# Altium schematic sheet LionIRVT-PMP15043-1.SchDoc
size A4; Date: Not shown in title block; ApprovedBy: Not shown in title block; CheckedBy: Not shown in title block; Author: Not shown in title block; CompanyName: Not shown in title block; Engineer: Not shown in title block; Organization: Not shown in title block; Address1: Not shown in title block; Address2: Not shown in title block; Address3: Not shown in title block; Address4: Not shown in title block; DocumentNumber: 1; Revision: Use project parameter SCH_Rev; SheetNumber: 2; SheetTotal: 3; PageSetup: Record=PageOptions|CenterHorizontal=True|CenterVertical=True|PrintScale=1.00|XCorrection=1.00|YCorrection=1.00|PrintKind=0|BorderSize=5000000|LeftOffset=0|BottomOffset=0|Orientation=2|PaperLength=1000|PaperWidth=1000|Scale=100|PaperSource=15|PrintQuality=600|MediaType=1|DitherType=10|PaperKind=Letter|PrintScaleMode=1; CurrentTime: Not shown in title block; CurrentDate: Not shown in title block; Time: Not shown in title block; DocumentFullPathAndName: Not shown in title block; DocumentName: Not shown in title block; ModifiedDate: Not shown in title block; ImagePath: Not shown in title block
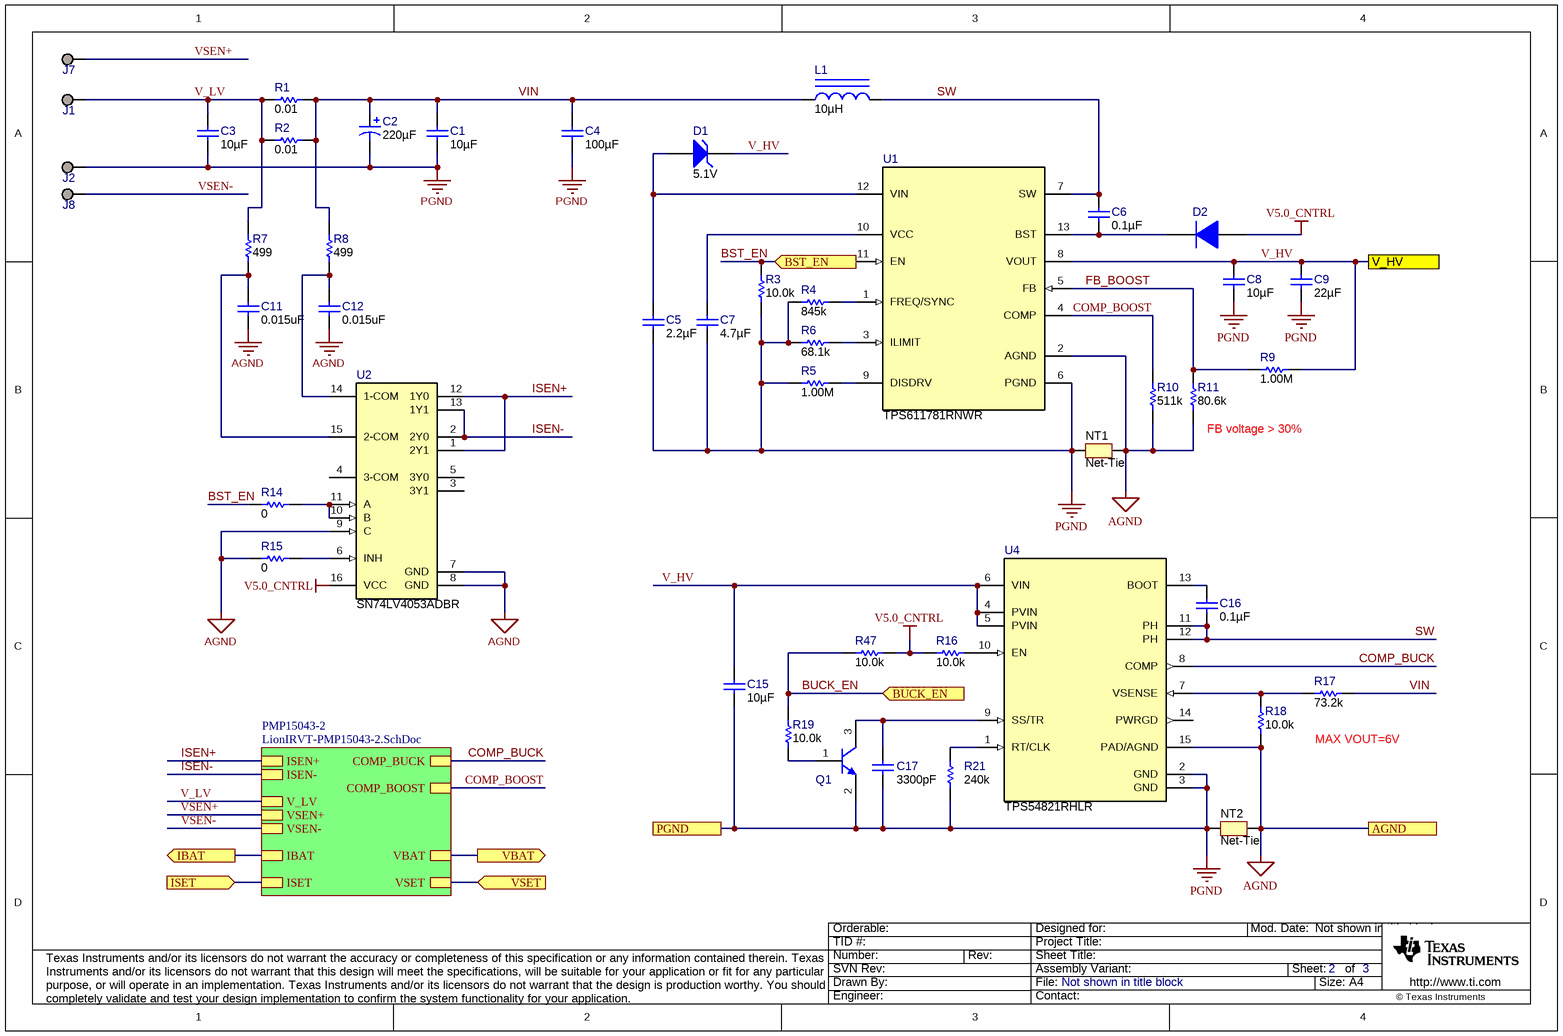
[diagram p0: LionIRVT-PMP15043-1.SchDoc]

## Parts
C1  ValueDisplayed: 10µF  [0603]  (hidden comment: GRM188R61E106MA73D)
C2  ValueDisplayed: 220µF  [SM_RADIAL_G]  (hidden comment: EEE-FC1E221P)
C3  ValueDisplayed: 10µF  [0603]  (hidden comment: GRM188R61E106MA73D)
C4  ValueDisplayed: 100µF  [1210_270]  (hidden comment: GRM32ER61A107ME20L)
C5  ValueDisplayed: 2.2µF  [0402_070]  (hidden comment: GRM155R61E225KE11D)
C6  ValueDisplayed: 0.1µF  [0402]  (hidden comment: GRM155R61C104KA88D)
C7  ValueDisplayed: 4.7µF  [0402]  (hidden comment: GRM155R61A475MEAAD)
C8  ValueDisplayed: 10µF  [0603]  (hidden comment: GRM188R61E106MA73D)
C9  ValueDisplayed: 22µF  [1210_270]  (hidden comment: GRM32ER61E226KE15L)
C11  ValueDisplayed: 0.015uF  [0603]  (hidden comment: Capacitor)
C12  ValueDisplayed: 0.015uF  [0603]  (hidden comment: Capacitor)
C15  ValueDisplayed: 10µF  [0603]  (hidden comment: GRM188R61E106MA73D)
C16  ValueDisplayed: 0.1µF  [0402]  (hidden comment: GRM155R61C104KA88D)
C17  ValueDisplayed: 3300pF  [0402]  (hidden comment: GRM155R71H332KA01D)
D1  value 5.1V  [SOD-323]  (hidden comment: BZT52C5V1S-7-F)
D2  1N4148X-TP  [SOD-523]  (value not drawn)
J1  Suggest using a net name here  [Keystone1502-2]  (value not drawn)
J2  Suggest using a net name here  [Keystone1502-2]  (value not drawn)
J7  Suggest using a net name here  [Keystone1502-2]  (value not drawn)
J8  Suggest using a net name here  [Keystone1502-2]  (value not drawn)
L1  ValueDisplayed: 10µH  [WE-HCC_1210]  (hidden comment: 7443321000)
NT1  Net-Tie  [Net-Tie_10mil]  (net tie, no BOM)
NT2  Net-Tie  [Net-Tie_10mil]  (net tie, no BOM)
Q1  MMBT3904-7-F  [SOT-23]  (value not drawn)
R1  ValueDisplayed: 0.01  [2010]  (hidden comment: CSRN2010FK10L0)
R2  ValueDisplayed: 0.01  [2010]  (hidden comment: CSRN2010FK10L0)
R3  ValueDisplayed: 10.0k  [0402]  (hidden comment: CRCW040210K0FKED)
R4  ValueDisplayed: 845k  [0402]  (hidden comment: CRCW0402845KFKED)
R5  ValueDisplayed: 1.00M  [0402]  (hidden comment: CRCW04021M00FKED)
R6  ValueDisplayed: 68.1k  [0402]  (hidden comment: CRCW040268K1FKED)
R7  ValueDisplayed: 499  [0603]  (hidden comment: CRCW0603499RFKEA)
R8  ValueDisplayed: 499  [0603]  (hidden comment: CRCW0603499RFKEA)
R9  ValueDisplayed: 1.00M  [0402]  (hidden comment: CRCW04021M00FKED)
R10  ValueDisplayed: 511k  [0402]  (hidden comment: CRCW0402511KFKED)
R11  ValueDisplayed: 80.6k  [0402]  (hidden comment: CRCW040280K6FKED)
R14  ValueDisplayed: 0  [0603]  (hidden comment: CRCW06030000Z0EA)
R15  ValueDisplayed: 0  [0603]  (hidden comment: CRCW06030000Z0EA)
R16  ValueDisplayed: 10.0k  [0402]  (hidden comment: CRCW040210K0FKED)
R17  ValueDisplayed: 73.2k  [0402]  (hidden comment: CRCW040273K2FKED)
R18  ValueDisplayed: 10.0k  [0402]  (hidden comment: CRCW040210K0FKED)
R19  ValueDisplayed: 10.0k  [0402]  (hidden comment: CRCW040210K0FKED)
R21  ValueDisplayed: 240k  [0402]  (hidden comment: CRCW0402240KFKED)
R47  ValueDisplayed: 10.0k  [0402]  (hidden comment: CRCW040210K0FKED)
U1  TPS611781RNWR  [RNW0013A]
U2  SN74LV4053ADBR  [DB0016A_N]
U4  TPS54821RHLR  [RHL0014A]

## Sub-sheets
PMP15043-2 = LionIRVT-PMP15043-2.SchDoc: VSET, VBAT, COMP_BUCK, COMP_BOOST, ISEN-, V_LV, IBAT, VSEN-, VSEN+, ISET, ISEN+

## Ports
AGND, BST_EN (in), BUCK_EN (in), IBAT (out), ISET (in), PGND, V_HV, VBAT (out), VSET (in)

## Nets
AGND: C11.2 C12.2 NT1.2 NT2.2 R10.1 R11.1 R15.1 R18.1 U1.2(AGND) U2.7(GND) U2.8(GND) U2.9(C) U4.15(PAD/AGND) ; port AGND
PGND: C1.2 C2.2(-) C3.2 C4.2 C5.1 C7.2 C8.2 C9.2 C15.2 C17.2 J2.1 NT1.1 NT2.1 Q1.2(E) R3.1 R4.1 R5.1 R6.1 R21.1 U1.6(PGND) U4.2(GND) U4.3(GND) ; port PGND
V5.0_CNTRL: D2.2(A) R16.1 R47.2 U2.16(VCC)
BST_EN: R3.2 R14.1 U1.11(EN) ; port BST_EN
BUCK_EN: R19.1 R47.1 ; port BUCK_EN
COMP_BOOST: R10.2 U1.4(COMP) ; sheet PMP15043-2/COMP_BOOST
COMP_BUCK: U4.8(COMP) ; sheet PMP15043-2/COMP_BUCK
FB_BOOST: R9.1 R11.2 U1.5(FB)
IBAT: port IBAT, sheet PMP15043-2/IBAT
ISEN+: U2.1(2Y1) U2.12(1Y0) ; sheet PMP15043-2/ISEN+
ISEN-: U2.2(2Y0) U2.13(1Y1) ; sheet PMP15043-2/ISEN-
ISET: port ISET, sheet PMP15043-2/ISET
SW: C6.1 C16.2 L1.2 U1.7(SW) U4.11(PH) U4.12(PH)
V_HV: C8.1 C9.1 C15.1 D1.1(K) R9.2 U1.8(VOUT) U4.4(PVIN) U4.5(PVIN) U4.6(VIN) ; port V_HV
V_LV: C3.1 J1.1 R1.1 R2.1 R7.2 ; sheet PMP15043-2/V_LV
VBAT: port VBAT, sheet PMP15043-2/VBAT
VIN: C1.1 C2.1(+) C4.1 L1.1 R1.2 R2.2 R8.2 R17.1
VSEN+: J7.1 ; sheet PMP15043-2/VSEN+
VSEN-: J8.1 ; sheet PMP15043-2/VSEN-
VSET: port VSET, sheet PMP15043-2/VSET
NetC5_2: C5.2 D1.2(A) U1.12(VIN)
NetC6_2: C6.2 D2.1(K) U1.13(BST)
NetC7_1: C7.1 U1.10(VCC)
NetC11_1: C11.1 R7.1 U2.15(2-COM)
NetC12_1: C12.1 R8.1 U2.14(1-COM)
NetC16_1: C16.1 U4.13(BOOT)
NetC17_1: C17.1 Q1.3(C) U4.9(SS/TR)
NetQ1_1: Q1.1(B) R19.2
NetR4_2: R4.2 U1.1(FREQ/SYNC)
NetR5_2: R5.2 U1.9(DISDRV)
NetR6_2: R6.2 U1.3(ILIMIT)
NetR14_2: R14.2 U2.10(B) U2.11(A)
NetR15_2: R15.2 U2.6(INH)
NetR16_2: R16.2 U4.10(EN)
NetR17_2: R17.2 R18.2 U4.7(VSENSE)
NetR21_2: R21.2 U4.1(RT/CLK)

Not connected (* = marked no-connect by the designer): U2 3(3Y1) 4(3-COM) 5(3Y0); U4 14(PWRGD)

## Notes on the sheet
- (near R11) FB voltage > 30%
- MAX VOUT=6V
- Drawn By:
- SVN Rev:
- Number:
- TID #:
- Orderable:
- Rev:
- Sheet Title:
- File:
- Project Title:
- Designed for:
- Assembly Variant:
- Mod. Date:
- Sheet:
- Size:
- of
- A4
- http://www.ti.com
- Texas Instruments and/or its licensors do not warrant the accuracy or completeness of this specification or any information contained therein. Texas Instruments and/or its licensors do not warrant that this design will meet the specifications, will be suitable for your application or fit for any particular purpose, or will operate in an implementation. Texas Instruments and/or its licensors do not warrant that the design is production worthy. You should completely validate and test your design implementation to confirm the system functionality for your application.
- Engineer:
- Contact:
- © Texas Instruments

## Library data of the parts
C1 C3 C8 C15 = GRM188R61E106MA73D: CAP, CERM, 10 µF, 25 V, +/- 20%, X5R, 0603; Manufacturer: MuRata; Polarized: N; CompType: Capacitor; Value: 10uF; U/M: EA; Cap_F: 0.00001; Tolerance_%: 20; Value1: Unknown; VDC_V: 25; Value2: 25V; TaMin_C: -55; TaMax_C: 85; AEC Category: Q200; SymbolVersion: 2008-07-09; PartNumber: GRM188R61E106MA73D; PackageReference: 0603; RoHS: Y; MountType: SMT; Technology: Ceramic; TempCo: X5R; Cap_Case: 0603; Published: 2008-06-19; Publisher: Texas Instruments; LatestRevisionDate: 2016-04-09; ComponentLink1Description: Datasheet link; ComponentLink1URL: http://psearch.murata.com/capacitor/product/GRM188R61E106MA73%23.pdf; Supplier 1: Digi-Key; Supplier Part Number 1: 490-7202-1-ND; Supplier 2: Mouser; Supplier Part Number 2: 81-GRM188R61E106MA3L; Supplier 3: Farnell; Supplier Part Number 3: 1828803RL; AEC Qualified: ?
C2 = EEE-FC1E221P: CAP, AL, 220 µF, 25 V, +/- 20%, 0.15 ohm, SMD; Manufacturer: Panasonic; Polarized: Y; CompType: Capacitor; Value: 220uF; U/M: EA; Cap_F: 0.00022; Tolerance_%: 20; VDC_V: 25; Value2: 25V; ESR_ohm: 0.15; IRMS_A: 0.67; TaMin_C: -40; TaMax_C: 105; Cap_Case: G; SizeAreaWB_mm2: 172.2; SizeArea_mm2: 123.6; SizeX_mm: 12; SizeY_mm: 10.3; SizeZ_mm: 10.2; AEC Category: Q200; SymbolVersion: 2008-07-09; PartNumber: EEE-FC1E221P; PackageReference: SMT Radial G; RoHS: Y; Value1: 0.15 ohm; MountType: SMT; Technology: AL; Series: FC; Publisher: Texas Instruments; LatestRevisionDate: 2017-03-23; ComponentLink1Description: Datasheet link; ComponentLink1URL: http://www.panasonic.com/industrial/components/pdf/smt_aec_050505.pdf; Supplier 1: Digi-Key; Supplier Part Number 1: PCE4005CT-ND; Supplier 2: Mouser; Supplier Part Number 2: 667-EEE-FC1E221P; Supplier 3: Farnell; Supplier Part Number 3: 1244363; AEC Qualified: ?
C4 = GRM32ER61A107ME20L: CAP, CERM, 100 µF, 10 V,+/- 20%, X5R, 1210; Manufacturer: MuRata; Polarized: N; CompType: Capacitor; Value: 100uF; U/M: EA; Cap_F: 0.0001; Tolerance_%: 20; Value1: Unknown; VDC_V: 10; Value2: 10V; TaMin_C: -55; TaMax_C: 85; Cap_Case: 1210; SizeArea_mm2: 8; SizeAreaWB_mm2: 14.7; SizeX_mm: 3.2; SizeY_mm: 2.5; SizeZ_mm: 2.7; AEC Category: Q200; SymbolVersion: 2008-07-09; PartNumber: GRM32ER61A107ME20L; PackageReference: 1210; RoHS: Y; MountType: SMT; Technology: Ceramic; TempCo: X5R; Published: 2008-06-19; Publisher: Texas Instruments; LatestRevisionDate: 2017-06-02; ComponentLink1Description: Datasheet link; ComponentLink1URL: http://www.murata.com/~/media/webrenewal/support/library/catalog/products/capacitor/mlcc/c02e.pdf; Supplier 1: Digi-Key; Supplier Part Number 1: 490-9969-1-ND; Supplier 2: Mouser; Supplier Part Number 2: 81-GRM32ER61A107ME0L; AEC Qualified: N; AEC Grade: N/A
C5 = GRM155R61E225KE11D: CAP, CERM, 2.2 µF, 25 V,+/- 10%, X5R, 0402; Manufacturer: MuRata; Polarized: N; CompType: Capacitor; Value: 2.2uF; U/M: EA; Cap_F: 0.0000022; Tolerance_%: 10; Value1: Unknown; VDC_V: 25; Value2: 25V; TaMin_C: -55; TaMax_C: 85; Cap_Case: 0402; AEC Category: Q200; SizeArea_mm2: 0.5; SizeAreaWB_mm2: 3; SizeX_mm: 1; SizeZ_mm: 0.7; Green_Lifecycle: Active; Green_REACh: Passed; SymbolVersion: 2008-07-09; PartNumber: GRM155R61E225KE11D; PackageReference: 0402; RoHS: Y; MountType: SMT; Technology: Ceramic; TempCo: X5R; Published: 2008-06-19; Publisher: Texas Instruments; LatestRevisionDate: 2017-06-02; ComponentLink1Description: Datasheet link; ComponentLink1URL: http://www.murata.com/~/media/webrenewal/support/library/catalog/products/capacitor/mlcc/c02e.ashx; Supplier 1: Digi-Key; Supplier Part Number 1: GRM155R61E225KE11D-ND; Supplier 2: Mouser; Supplier Part Number 2: 81-GRM155R61E225KE1D; AEC Qualified: ?; SizeY_mm: 0.5; Green_EU RoHS: Passed; Green_EU RoHS-2: Incomplete
C6 C16 = GRM155R61C104KA88D: CAP, CERM, 0.1 µF, 16 V, +/- 10%, X5R, 0402; Manufacturer: MuRata; Polarized: N; CompType: Capacitor; Value: 0.1uF; U/M: EA; Cap_F: 0.0000001; Tolerance_%: 10; Value1: Unknown; VDC_V: 16; Value2: 16V; TaMin_C: -55; TaMax_C: 85; AEC Category: Q200; SymbolVersion: 2008-07-09; PartNumber: GRM155R61C104KA88D; PackageReference: 0402; RoHS: Y; MountType: SMT; Technology: Ceramic; TempCo: X5R; Cap_Case: 0402; Published: 2008-06-19; Publisher: Texas Instruments; LatestRevisionDate: 2016-04-09; ComponentLink1Description: Datasheet link; ComponentLink1URL: http://search.murata.co.jp/Ceramy/PnsearchViewAction.do?HnOFG=ON&HnNFG=ON&SEL_CNT=50&sLang=en&sKey=GRM155R61C104KA88D&x=9&y=9&search=startwith; Supplier 1: Digi-Key; Supplier Part Number 1: 490-5415-1-ND; Supplier 2: Mouser; Supplier Part Number 2: 81-GRM155R61C104KA8D; AEC Qualified: ?
C7 = GRM155R61A475MEAAD: CAP, CERM, 4.7 µF, 10 V, +/- 20%, X5R, 0402; Manufacturer: MuRata; Polarized: N; CompType: Capacitor; Value: 4.7uF; U/M: EA; Cap_F: 0.0000047; Tolerance_%: 20; Value1: Unknown; VDC_V: 10; Value2: 10V; TaMin_C: -55; TaMax_C: 85; SizeArea_mm2: 0.5; SizeAreaWB_mm2: 3; SizeX_mm: 1; SizeZ_mm: 0.6; AEC Category: Q200; SymbolVersion: 2008-07-09; PartNumber: GRM155R61A475MEAAD; PackageReference: 0402; RoHS: Y; MountType: SMT; Technology: Ceramic; TempCo: X5R; Cap_Case: 0402; SizeY_mm: 0.5; Published: 2008-06-19; Publisher: Texas Instruments; LatestRevisionDate: 2016-11-23; ComponentLink1Description: Datasheet link; ComponentLink1URL: http://search.murata.co.jp/Ceramy/image/img/A01X/G101/ENG/GRM155R61A475MEAA-01.pdf; AEC Qualified: N; AEC Grade: N/A
C9 = GRM32ER61E226KE15L: CAP, CERM, 22 µF, 25 V, +/- 10%, X5R, 1210; Manufacturer: MuRata; Polarized: N; CompType: Capacitor; Value: 22uF; U/M: EA; Cap_F: 0.000022; Tolerance_%: 10; ESR_ohm: 0.002; Value1: 0.002 ohm; VDC_V: 25; Value2: 25V; IRMS_A: 3.67; TaMin_C: -55; TaMax_C: 85; Cap_Case: 1210; SizeArea_mm2: 8; SizeAreaWB_mm2: 14.7; SizeX_mm: 3.2; SizeY_mm: 2.5; SizeZ_mm: 2.7; AEC Category: Q200; SymbolVersion: 2008-07-09; PartNumber: GRM32ER61E226KE15L; PackageReference: 1210; RoHS: Y; MountType: SMT; Technology: Ceramic; TempCo: X5R; Published: 2008-06-19; Publisher: Texas Instruments; LatestRevisionDate: 2016-11-23; ComponentLink1Description: Datasheet link; ComponentLink1URL: http://search.murata.co.jp/Ceramy/PnsearchViewAction.do?HnOFG=ON&HnNFG=ON&SEL_CNT=50&sLang=en&sKey=GRM32ER61E226KE15L&x=9&y=9&search=startwith; Supplier 1: Mouser; Supplier Part Number 1: 81-GRM32ER61E226KE15; Supplier 2: Farnell; Supplier Part Number 2: 1828821; AEC Qualified: ?
C11 C12 = CMP-0007383-5: CAP, CERM, 0.015 uF, 16 V, +/- 10%, X7R, 0603; PartNumber: GRM188R71C153KA01D; Manufacturer: MuRata; Polarized: N; U/M: EA; Cap_F: 15nF; Value1: Unknown; VDC_V: 16V; TaMin_C: -55°C; TaMax_C: 125°C; SizeArea_mm2: 1.28; SizeAreaWB_mm2: 4.68; SizeX_mm: 1.6; SizeY_mm: 0.8; SizeZ_mm: 1; AEC Category: Q200; CompType: Capacitor; Value: 0.015uF; PackageReference: 0603; RoHS: Y; Tolerance_%: 10%; Value2: 16V; MountType: SMT; Technology: Ceramic; TempCo: X7R; Cap_Case: 0603; Published: 2008-06-19; Publisher: Texas Instruments; LatestRevisionDate: 2017-03-09; ComponentLink1Description: Datasheet link; ComponentLink1URL: http://search.murata.co.jp/Ceramy/PnsearchViewAction.do?HnOFG=ON&HnNFG=ON&SEL_CNT=50&sLang=en&sKey=GRM188R71C153KA01D&x=9&y=9&search=startwith; Supplier 1: Mouser; Supplier Part Number 1: 81-GRM188R71C153KA; AEC Qualified: ?
C17 = GRM155R71H332KA01D: CAP, CERM, 3300 pF, 50 V,+/- 10%, X7R, 0402; Manufacturer: MuRata; Polarized: N; CompType: Capacitor; Value: 3300pF; U/M: EA; Cap_F: 0.0000000033; Tolerance_%: 10; Value1: Unknown; VDC_V: 50; Value2: 50V; TaMin_C: -55; TaMax_C: 125; SizeArea_mm2: 0.5; SizeAreaWB_mm2: 3; SizeX_mm: 1; SizeZ_mm: 0.6; AEC Category: Q200; Green_Lifecycle: Active; Green_REACh: Passed; SymbolVersion: 2008-07-09; PartNumber: GRM155R71H332KA01D; PackageReference: 0402; RoHS: Y; MountType: SMT; Technology: Ceramic; TempCo: X7R; Cap_Case: 0402; SizeY_mm: 0.5; Published: 2008-06-19; Publisher: Texas Instruments; LatestRevisionDate: 2017-06-02; ComponentLink1Description: Datasheet link; ComponentLink1URL: http://search.murata.co.jp/Ceramy/PnsearchViewAction.do?HnOFG=ON&HnNFG=ON&SEL_CNT=50&sLang=en&sKey=GRM155R71H332KA01D&x=9&y=9&search=startwith; Supplier 1: Digi-Key; Supplier Part Number 1: 490-3248-1-ND; Supplier 2: Mouser; Supplier Part Number 2: 81-GRM36X332K50; AEC Qualified: ?; Green_EU RoHS: Passed; Green_EU RoHS-2: Passed
D1 = BZT52C5V1S-7-F: Diode, Zener, 5.1 V, 200 mW, SOD-323; Manufacturer: Diodes Inc.; SymbolCreator: a0412235; U/M: EA; Power_W: 0.2; Vz_V: 5.1; Value1: 0.2W; RJA_CperW: 625; SizeAreaWB_mm2: 8.695; SizeArea_mm2: 3.645; SizeX_mm: 2.7; SizeY_mm: 1.35; SizeZ_mm: 1; AEC Category: Q101; Green_Lifecycle: Active; Green_REACh: Passed; SymbolVersion: 2010-08-25; PartNumber: BZT52C5V1S-7-F; PackageReference: SOD-323; CompType: Zener; Vr_V: N/A; MountType: SMT; RoHS: Y; ComponentLink1Description: Datasheet link; ComponentLink1URL: http://www.diodes.com/datasheets/ds30093.pdf; Published: 2008-10-08; Publisher: Texas Instruments; LatestRevisionDate: 2017-05-11; LatestRevisionNote: Updated Supplier Data; Supplier 1: Digi-Key; Supplier Part Number 1: BZT52C5V1S-FDICT-ND; Supplier 2: Mouser; Supplier Part Number 2: 621-BZT52C5V1S-F; AEC Qualified: ?; Green_EU RoHS: Passed; Green_EU RoHS-2: Passed
D2 = 1N4148X-TP: Diode, Switching, 75 V, 0.3 A, SOD-523; Manufacturer: Micro Commercial Components; U/M: EA; Vf_V: 1.25; Value: 75V; Value1: 0.3A; Value2: 1.25V; Io_A: 0.3; Vr_V: 75; TJmax_C: 150; SizeAreaWB_mm2: 5.13; SizeArea_mm2: 1.53; SizeX_mm: 1.7; SizeY_mm: 0.9; SizeZ_mm: 0.65; AEC Category: Q101; Green_Lifecycle: Not Set; Green_REACh: Incomplete; SymbolVersion: 2008-12-08; PartNumber: 1N4148X-TP; PackageReference: SOD-523; CompType: Diode; MountType: SMT; Type: Switching; RoHS: Y; Published: 2008-06-26; Publisher: Texas Instruments; LatestRevisionDate: 2017-05-30; ComponentLink1Description: Datasheet link; ComponentLink1URL: http://www.mccsemi.com/up_pdf/1N4148X(SOD-523).PDF; Supplier 1: Digi-Key; Supplier Part Number 1: 1N4148XTPMSCT-ND; Supplier 2: Newark; Supplier Part Number 2: 69R6666; Supplier 3: Mouser; Supplier Part Number 3: 833-1N4148X-TP; AEC Qualified: ?; Green_EU RoHS: Incomplete; Green_EU RoHS-2: Incomplete
J1 J2 J7 J8 = 1502-2: Terminal, Turret, TH, Double; Manufacturer: Keystone; CompType: Turret Terminal; U/M: EA; SymbolVersion: 2010-10-20; PartNumber: 1502-2; PackageReference: Keystone1502-2; RoHS: Y; MountType: TH; ComponentLink1Description: Datasheet Link; ComponentLink1URL: http://www.keyelco.com/pdfs/M55p126.pdf; Value: Double; Publisher: Texas Instruments; LatestRevisionDate: 2015-05-13; Supplier 1: Digi-Key; Supplier Part Number 1: 1502-2K-ND
L1 = 7443321000: Inductor, Shielded Drum Core, Ferrite, 10 µH, 9 A, 0.0144 ohm, SMD; Manufacturer: Wurth Elektronik; Value: 10uH; Ind_H: 10.0E-6; Imax_A: 9; Irms: 9A @ 50C rise; Isat: 10A @ 30% inductance drop; DCR_ohm: 0.0144; Value2: 9A; SizeAreaWB_mm2: 188.94; SizeArea_mm2: 137.94; SizeX_mm: 12.1; SizeY_mm: 11.4; SizeZ_mm: 10; AEC Category: Q200; Green_Lifecycle: Active; Green_REACh: Passed; SymbolVersion: 2008-07-23; CompType: Inductor; PartNumber: 7443321000; Value1: 0.0144 ohm; Technology: Shielded Drum Core; MountType: SMT; Material: Ferrite; PackageReference: 12.1x9.5x11.4mm; Published: 2008-06-26; Publisher: Texas Instruments; LatestRevisionDate: 2017-05-24; ComponentLink1Description: Datasheet link; ComponentLink1URL: http://katalog.we-online.de/pbs/datasheet/7443321000.pdf; RoHS: Y; Supplier 1: Digi-Key; Supplier Part Number 1: 732-2145-1-ND; Supplier 2: Mouser; Supplier Part Number 2: 710-7443321000; Supplier 3: Farnell; Supplier Part Number 3: 1848238; AEC Qualified: ?; Green_EU RoHS: Passed; Green_EU RoHS-2: Incomplete
NT1 NT2 = Net-Tie: Single point connection between nets.; SymbolCreator: codlsc; SymbolVersion: 2009-07-01; MountType: SMT; PackageReference: N/A; Publisher: Texas Instruments; LatestRevisionDate: 2014-10-27; LatestRevisionNote: Added Alternate PartNumber and Alternate Manufacturer parameters to appropriate components.
Q1 = MMBT3904-7-F, Diodes Inc.: Transistor, NPN, 40 V, 0.2 A, SOT-23; CompType: BJT; PNP: 0; NPN: 1; Vceo_V: 40; Vcesat1_V: 0.2; Value: 40 V; Value1: 0.2 A; HfeMax: 400; TaMin_C: -55; TaMax_C: 150; SizeAreaWB_mm2: 14; SizeArea_mm2: 7.5; SizeX_mm: 2.5; SizeY_mm: 3; SizeZ_mm: 1.1; U/M: EA; AEC Category: Q101; SymbolVersion: 2008-07-31; PartNumber: MMBT3904-7-F; Manufacturer: Diodes Inc.; PackageReference: SOT-23; RoHS: Y; IcRated_A: 0.2; Value2: 400; Published: 2008-07-31; LatestRevisionDate: 2017-03-24; Publisher: Texas Instruments; ComponentLink1Description: Datasheet link; ComponentLink1URL: http://www.diodes.com/datasheets/ds30036.pdf; Supplier 1: Digi-Key; Supplier Part Number 1: MMBT3904-FDICT-ND; Supplier 2: Farnell; Supplier Part Number 2: 1773602; MountType: SMT; AEC Qualified: ?
R1 R2 = CSRN2010FK10L0: RES, 0.01, 1%, 1 W, 2010; Manufacturer: Stackpole Electronics Inc; CompType: Resistor; Value: 0.01; Value_Code: R010; Tolerance_%: 1; Value2: 1W; TempCo: 250 ppm/C; SizeArea_mm2: 12.5; SizeX_mm: 5; SizeY_mm: 2.5; SizeZ_mm: 1.66; EIA_Code: E96; U/M: EA; AEC Category: Q200; SymbolVersion: 2009-05-29; PartNumber: CSRN2010FK10L0; PackageReference: 2010; RoHS: Y; Res_ohm: 0.01; Value1: 1%; Power_W: 1; MountType: SMT; Technology: Thick Film; Published: 2008-06-26; Publisher: Texas Instruments; LatestRevisionDate: 2017-04-20; ComponentLink1Description: Datasheet link; ComponentLink1URL: http://www.seielect.com/Catalog/SEI-csr.pdf; Supplier 1: Digi-Key; Supplier Part Number 1: CSRN2010FK10L0CT-ND; AEC Qualified: ?
R3 R16 R18 R19 R47 = CRCW040210K0FKED: RES, 10.0 k, 1%, 0.063 W, 0402; Manufacturer: Vishay-Dale; CompType: Resistor; Value: 10.0k; Res_ohm: 10000; Value_Code: 10k0; Tolerance_%: 1; Power_W: 0.063; Value2: 0.063W; VDC_V: 50; TempCo: 100 ppm/C; SizeArea_mm2: 0.5; SizeZ_mm: 0.6; EIA_Code: E96; U/M: EA; AEC Category: Q200; SymbolVersion: 2009-05-29; PartNumber: CRCW040210K0FKED; PackageReference: 0402; RoHS: Y; Value1: 1%; MountType: SMT; Technology: Thick Film; SizeX_mm: 1; SizeY_mm: 0.5; Published: 2008-06-26; Publisher: Texas Instruments; LatestRevisionDate: 2017-03-21; ComponentLink1Description: Datasheet link; ComponentLink1URL: http://www.vishay.com/docs/20035/dcrcwe3.pdf; Supplier 1: Digi-Key; Supplier Part Number 1: 541-10.0KLCT-ND; Supplier 2: Newark; Supplier Part Number 2: 52K6595; Supplier 3: Mouser; Supplier Part Number 3: 71-CRCW0402-10K-E3; AEC Qualified: ?
R4 = CRCW0402845KFKED: RES, 845 k, 1%, 0.063 W, 0402; Manufacturer: Vishay-Dale; CompType: Resistor; Value: 845k; Res_ohm: 845000; Tolerance_%: 1; Power_W: 0.063; Value2: 0.063W; VDC_V: 50; TempCo: 100 ppm/C; SizeArea_mm2: 0.5; SizeZ_mm: 0.6; EIA_Code: E96; U/M: EA; AEC Category: Q200; SymbolVersion: 2009-05-29; PartNumber: CRCW0402845KFKED; PackageReference: 0402; RoHS: Y; Value_Code: 845k; Value1: 1%; MountType: SMT; Technology: Thick Film; SizeX_mm: 1; SizeY_mm: 0.5; Published: 2008-06-26; Publisher: Texas Instruments; LatestRevisionDate: 2017-06-03; ComponentLink1Description: Datasheet link; ComponentLink1URL: http://www.vishay.com/docs/20035/dcrcwe3.pdf; Supplier 1: Digi-Key; Supplier Part Number 1: 541-845KLCT-ND; Supplier 2: Newark; Supplier Part Number 2: 52K7315; Supplier 3: Mouser; Supplier Part Number 3: 71-CRCW0402-845K-E3; AEC Qualified: ?
R5 R9 = CRCW04021M00FKED: RES, 1.00 M, 1%, 0.063 W, 0402; Manufacturer: Vishay-Dale; CompType: Resistor; Value: 1.00Meg; Res_ohm: 1000000; Value_Code: 1M00; Tolerance_%: 1; Power_W: 0.063; Value2: 0.063W; VDC_V: 50; TempCo: 100 ppm/C; SizeArea_mm2: 0.5; SizeZ_mm: 0.6; EIA_Code: E96; U/M: EA; AEC Category: Q200; SymbolVersion: 2009-05-29; PartNumber: CRCW04021M00FKED; PackageReference: 0402; RoHS: Y; Value1: 1%; MountType: SMT; Technology: Thick Film; SizeX_mm: 1; SizeY_mm: 0.5; Published: 2008-06-26; Publisher: Texas Instruments; LatestRevisionDate: 2016-06-07; ComponentLink1Description: Datasheet link; ComponentLink1URL: http://www.vishay.com/docs/20035/dcrcwe3.pdf; Supplier 1: Digi-Key; Supplier Part Number 1: 541-1.00MLCT-ND; Supplier 2: Mouser; Supplier Part Number 2: 71-CRCW0402-1.0M-E3; Supplier 3: Farnell; Supplier Part Number 3: 1469667; AEC Qualified: ?
R6 = CRCW040268K1FKED: RES, 68.1 k, 1%, 0.063 W, 0402; Manufacturer: Vishay-Dale; CompType: Resistor; Value: 68.1k; Res_ohm: 68100; Value_Code: 68k1; Tolerance_%: 1; Power_W: 0.063; Value2: 0.063W; VDC_V: 50; TempCo: 100 ppm/C; SizeArea_mm2: 0.5; SizeZ_mm: 0.6; EIA_Code: E96; U/M: EA; AEC Category: Q200; Green_Lifecycle: Active; Green_REACh: Passed; SymbolVersion: 2009-05-29; PartNumber: CRCW040268K1FKED; PackageReference: 0402; RoHS: Y; Value1: 1%; MountType: SMT; Technology: Thick Film; SizeX_mm: 1; SizeY_mm: 0.5; Published: 2008-06-26; Publisher: Texas Instruments; LatestRevisionDate: 2017-06-03; ComponentLink1Description: Datasheet link; ComponentLink1URL: http://www.vishay.com/docs/20035/dcrcwe3.pdf; Supplier 1: Digi-Key; Supplier Part Number 1: 541-68.1KLCT-ND; Supplier 2: Newark; Supplier Part Number 2: 52K7227; Supplier 3: Mouser; Supplier Part Number 3: 71-CRCW0402-68.1K-E3; AEC Qualified: ?; Green_EU RoHS: Passed with Exemption; Green_EU RoHS-2: Passed
R7 R8 = CRCW0603499RFKEA: RES, 499, 1%, 0.1 W, 0603; Manufacturer: Vishay-Dale; CompType: Resistor; Value: 499; Value_Code: 499R; Tolerance_%: 1; Power_W: 0.1; Value2: 0.1W; VDC_V: 75; TempCo: 100 ppm/C; SizeArea_mm2: 1.28; SizeX_mm: 1.6; SizeY_mm: 0.8; EIA_Code: E96; U/M: EA; AEC Category: Q200; Green_Lifecycle: Active; Green_REACh: Passed; SymbolVersion: 2009-05-29; PartNumber: CRCW0603499RFKEA; PackageReference: 0603; RoHS: Y; Res_ohm: 499; Value1: 1%; MountType: SMT; Technology: Thick Film; SizeZ_mm: 1; Published: 2008-06-26; Publisher: Texas Instruments; LatestRevisionDate: 2017-05-31; ComponentLink1Description: Datasheet link; ComponentLink1URL: http://www.vishay.com/docs/20035/dcrcwe3.pdf; Supplier 1: Digi-Key; Supplier Part Number 1: 541-499HCT-ND; Supplier 2: Newark; Supplier Part Number 2: 52K8569; Supplier 3: Mouser; Supplier Part Number 3: 71-CRCW0603-499-E3; AEC Qualified: ?; Green_EU RoHS: Passed with Exemption; Green_EU RoHS-2: Passed
R10 = CRCW0402511KFKED: RES, 511 k, 1%, 0.063 W, 0402; Manufacturer: Vishay-Dale; CompType: Resistor; Value: 511k; Res_ohm: 511000; Tolerance_%: 1; Power_W: 0.063; Value2: 0.063W; VDC_V: 50; TempCo: 100 ppm/C; SizeArea_mm2: 0.5; SizeZ_mm: 0.6; EIA_Code: E96; U/M: EA; AEC Category: Q200; SymbolVersion: 2009-05-29; PartNumber: CRCW0402511KFKED; PackageReference: 0402; RoHS: Y; Value_Code: 511k; Value1: 1%; MountType: SMT; Technology: Thick Film; SizeX_mm: 1; SizeY_mm: 0.5; Published: 2008-06-26; Publisher: Texas Instruments; LatestRevisionDate: 2017-06-03; ComponentLink1Description: Datasheet link; ComponentLink1URL: http://www.vishay.com/docs/20035/dcrcwe3.pdf; Supplier 1: Digi-Key; Supplier Part Number 1: 541-511KLCT-ND; Supplier 2: Newark; Supplier Part Number 2: 52K7134; Supplier 3: Mouser; Supplier Part Number 3: 71-CRCW0402-511K-E3; AEC Qualified: ?
R11 = CRCW040280K6FKED: RES, 80.6 k, 1%, 0.063 W, 0402; Manufacturer: Vishay-Dale; CompType: Resistor; Value: 80.6k; Res_ohm: 80600; Value_Code: 80k6; Tolerance_%: 1; Power_W: 0.063; Value2: 0.063W; VDC_V: 50; TempCo: 100 ppm/C; SizeArea_mm2: 0.5; SizeZ_mm: 0.6; EIA_Code: E96; U/M: EA; AEC Category: Q200; SymbolVersion: 2009-05-29; PartNumber: CRCW040280K6FKED; PackageReference: 0402; RoHS: Y; Value1: 1%; MountType: SMT; Technology: Thick Film; SizeX_mm: 1; SizeY_mm: 0.5; Published: 2008-06-26; Publisher: Texas Instruments; LatestRevisionDate: 2016-06-07; ComponentLink1Description: Datasheet link; ComponentLink1URL: http://www.vishay.com/docs/20035/dcrcwe3.pdf; Supplier 1: Digi-Key; Supplier Part Number 1: 541-80.6KLCT-ND; Supplier 2: Mouser; Supplier Part Number 2: 71-CRCW0402-80.6K-E3; Supplier 3: Farnell; Supplier Part Number 3: 1469736; AEC Qualified: ?
R14 R15 = CRCW06030000Z0EA: RES, 0, 5%, 0.1 W, 0603; Manufacturer: Vishay-Dale; CompType: Resistor; Value: 0; Value_Code: 0000; Tolerance_%: 5; Power_W: 0.1; Value2: 0.1W; VDC_V: 75; TempCo: 200 ppm/C; SizeArea_mm2: 1.28; SizeX_mm: 1.6; SizeY_mm: 0.8; SizeZ_mm: 1; EIA_Code: E24; U/M: EA; AEC Category: Q200; Green_Lifecycle: Active; Green_REACh: Passed; SymbolVersion: 2009-05-29; PartNumber: CRCW06030000Z0EA; PackageReference: 0603; RoHS: Y; Res_ohm: 0; Value1: 5%; MountType: SMT; Technology: Thick Film; Published: 2008-06-26; Publisher: Texas Instruments; LatestRevisionDate: 2017-05-31; ComponentLink1Description: Datasheet link; ComponentLink1URL: http://www.vishay.com/docs/20035/dcrcwe3.pdf; Supplier 1: Digi-Key; Supplier Part Number 1: 541-0.0GCT-ND; Supplier 2: Newark; Supplier Part Number 2: 52K8014; Supplier 3: Mouser; Supplier Part Number 3: 71-CRCW0603-0-E3; AEC Qualified: ?; Green_EU RoHS: Passed with Exemption; Green_EU RoHS-2: Passed
R17 = CRCW040273K2FKED: RES, 73.2 k, 1%, 0.063 W, 0402; Manufacturer: Vishay-Dale; CompType: Resistor; Value: 73.2k; Res_ohm: 73200; Value_Code: 73k2; Tolerance_%: 1; Power_W: 0.063; Value2: 0.063W; VDC_V: 50; TempCo: 100 ppm/C; SizeArea_mm2: 0.5; SizeZ_mm: 0.6; EIA_Code: E96; U/M: EA; AEC Category: Q200; Green_Lifecycle: Active; Green_REACh: Passed; SymbolVersion: 2009-05-29; PartNumber: CRCW040273K2FKED; PackageReference: 0402; RoHS: Y; Value1: 1%; MountType: SMT; Technology: Thick Film; SizeX_mm: 1; SizeY_mm: 0.5; Published: 2008-06-26; Publisher: Texas Instruments; LatestRevisionDate: 2017-06-03; ComponentLink1Description: Datasheet link; ComponentLink1URL: http://www.vishay.com/docs/20035/dcrcwe3.pdf; Supplier 1: Digi-Key; Supplier Part Number 1: 541-73.2KLCT-ND; Supplier 2: Newark; Supplier Part Number 2: 52K7257; Supplier 3: Mouser; Supplier Part Number 3: 71-CRCW0402-73.2K-E3; AEC Qualified: ?; Green_EU RoHS: Passed with Exemption; Green_EU RoHS-2: Passed
R21 = CRCW0402240KFKED: RES, 240 k, 1%, 0.063 W, 0402; Manufacturer: Vishay-Dale; CompType: Resistor; Value: 240k; Res_ohm: 240000; Tolerance_%: 1; Power_W: 0.063; Value2: 0.063W; VDC_V: 50; TempCo: 100 ppm/C; SizeArea_mm2: 0.5; SizeZ_mm: 0.6; U/M: EA; AEC Category: Q200; Green_Lifecycle: Active; Green_REACh: Passed; SymbolVersion: 2009-05-29; PartNumber: CRCW0402240KFKED; PackageReference: 0402; RoHS: Y; Value_Code: 240k; Value1: 1%; MountType: SMT; Technology: Thick Film; SizeX_mm: 1; SizeY_mm: 0.5; Published: 2008-06-26; Publisher: Texas Instruments; LatestRevisionDate: 2017-06-03; ComponentLink1Description: Datasheet link; ComponentLink1URL: http://www.vishay.com/docs/20035/dcrcwe3.pdf; Supplier 1: Digi-Key; Supplier Part Number 1: 541-240KLCT-ND; Supplier 2: Newark; Supplier Part Number 2: 51P0040; Supplier 3: Mouser; Supplier Part Number 3: 71-CRCW0402240KFKED; AEC Qualified: ?; Green_EU RoHS: Passed with Exemption; Green_EU RoHS-2: Passed
U1 = TPS611781RNWR: 20-V, 10-A Fully-Integrated Synchronous Boost with Load Disconnect, RNW0013A (VQFN-HR-13); Alternate PartNumber: TPS611781RNWT; Manufacturer: Texas Instruments; SymbolCreator: Altium; CompType: IC; U/M: EA; SizeArea_mm2: 10.5; SizeAreaWB_mm2: 18; SizeX_mm: 3.5; SizeY_mm: 3; SizeZ_mm: 1; SymbolVersion: 2016-04-06; PartNumber: TPS611781RNWR; PackageReference: RNW0013A; MountType: SMT; ComponentLink1Description: Datasheet Link; ComponentLink1URL: https://sps06.itg.ti.com/sites/KMS/crossdivteams/altium/docs/ComponentDatasheets/TPS61178_0120.pdf; Publisher: Texas Instruments; LatestRevisionDate: 2017-06-03; Alternate Manufacturer: Texas Instruments; PackageDescription: VQFN-HR-13
U2 = SN74LV4053ADBR: Triple 2-Channel Analog Multiplexer/Demultiplexer, DB0016A, LARGE T&R; Manufacturer: Texas Instruments; Alternate PartNumber: Equivalent; VCC(Min)(V): 2; VCC(Max)(V): 5.5; Configuration: 3 X SPDT; Bandwidth(Max)(MHz): 50; Ron(Max)(Ohms): 75; Ron(Typ)(Ohms): 23; Crosstalk: Yes; Rating: Catalog; Output Type: CMOS; DatasheetVersion: SCLS430K; PackageReference: DB0016A; Generic Part Number: SN74LV4053A; Operating Temperature Range(C): -40 to 85; Code_JEDEC: MO-150; PartNumber: SN74LV4053ADBR; ComponentLink1Description: Manufacturer URL; ComponentLink1URL: http://www.ti.com/; ComponentLink2Description: Datasheet; ComponentLink2URL: http://www.ti.com/lit/ds/symlink/sn74lv4053a.pdf; ComponentLink3Description: Package Specification; ComponentLink3URL: http://www.ti.com/lit/ml/mpds507/mpds507.pdf; Alternate Manufacturer: Texas Instruments
U4 = TPS54821RHLR: 4.5V to 17V Input, 8-A Synchronous Step-Down Converter with Hiccup Current Limit, RHL0014A (VQFN-14); Alternate PartNumber: TPS54821RHLT; Manufacturer: Texas Instruments; SymbolCreator: Altium; SizeArea_mm2: 13.3225; SizeAreaWB_mm2: 21.6225; SizeX_mm: 3.65; SizeZ_mm: 1; CompType: IC; U/M: EA; Green_Lifecycle: Active; Green_REACh: Passed; SymbolVersion: 2015-12-22; PartNumber: TPS54821RHLR; PackageReference: RHL0014A; PackageDescription: VQFN-14; MountType: SMT; SizeY_mm: 3.65; ComponentLink1Description: Datasheet Link; ComponentLink1URL: http://www.ti.com/lit/ds/symlink/tps54821.pdf; RoHS: Y; Publisher: Texas Instruments; LatestRevisionDate: 2017-05-22; Alternate Manufacturer: Texas Instruments; Green_EU RoHS: Passed; Green_EU RoHS-2: Passed